# EAGLE design com-uart (EAGLE 6.1)
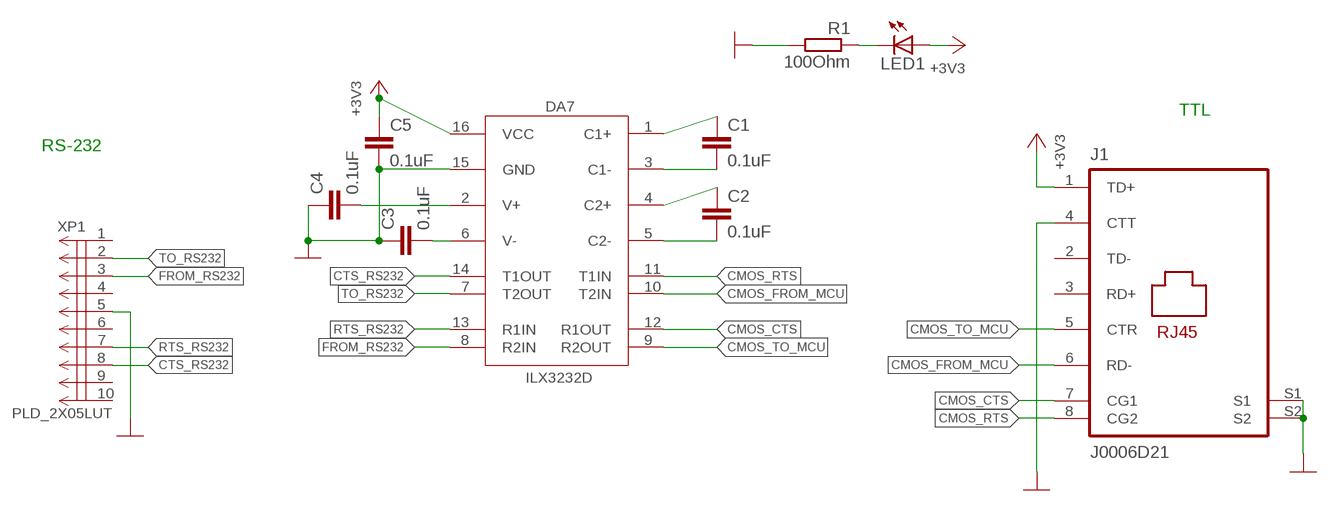
[diagram p0: schematic, sheet 1]

## Parts
C1  0.1uF  CAP0805  [0805]
C2  0.1uF  CAP0805  [0805]
C3  0.1uF  CAP0805  [0805]
C4  0.1uF  CAP0805  [0805]
C5  0.1uF  CAP0805  [0805]
DA7  ILX3232D  [SO16]
J1  J0006D21  [J0-C/D/E]
LED1  LED3MM  [LED3MM]
R1  100Ohm  RESISTOR0805  [0805]
XP1  PLD_2X05LUT  [PLD_2X05_LUT]

## Nets
+3V3: C5.1 DA7.16(VCC) J1.1(TD+) LED1.A
CMOS_CTS: DA7.12(R1OUT) J1.7(CG1)
CMOS_FROM_MCU: DA7.10(T2IN) J1.6(RD-)
CMOS_RTS: DA7.11(T1IN) J1.8(CG2)
CMOS_TO_MCU: DA7.9(R2OUT) J1.5(CTR)
CTS_RS232: DA7.14(T1OUT) XP1.8
FROM_RS232: DA7.8(R2IN) XP1.3
GND: C3.1 C4.1 C5.2 DA7.15(GND) J1.4(CTT) J1.S1 J1.S2 R1.2 XP1.5
N$1: LED1.K(C) R1.1
N$233: C4.2 DA7.2(V+)
N$235: C3.2 DA7.6(V-)
N$238: C1.2 DA7.3(C1-)
N$239: C1.1 DA7.1(C1+)
N$240: C2.1 DA7.4(C2+)
N$241: C2.2 DA7.5(C2-)
RTS_RS232: DA7.13(R1IN) XP1.7
TO_RS232: DA7.7(T2OUT) XP1.2
Unconnected: J1.2(TD-) J1.3(RD+) XP1.1 XP1.4 XP1.6 XP1.9 XP1.10

## Notes on the sheet
- TTL
- RS-232

## Library data of the parts
C1-C5 = barthess:CAP: Capacitor; PARTNO: ?
DA7 = transceiver:ILX3232: RS232 TRANSCEIVER Integral clone; PARTNO: ILX3232D
J1 = connector:J0006D21: RJ45 PulseJack
LED1 = SparkFun:LED: LEDs Standard schematic elements and footprints for 5mm, 3mm, 1206, and 0603 sized LEDs. 5mm - Spark Fun Electronics SKU : COM-00529 (and others)
R1 = barthess:RESISTOR: Resistor
XP1 = connector:PLD_2X05

## Board
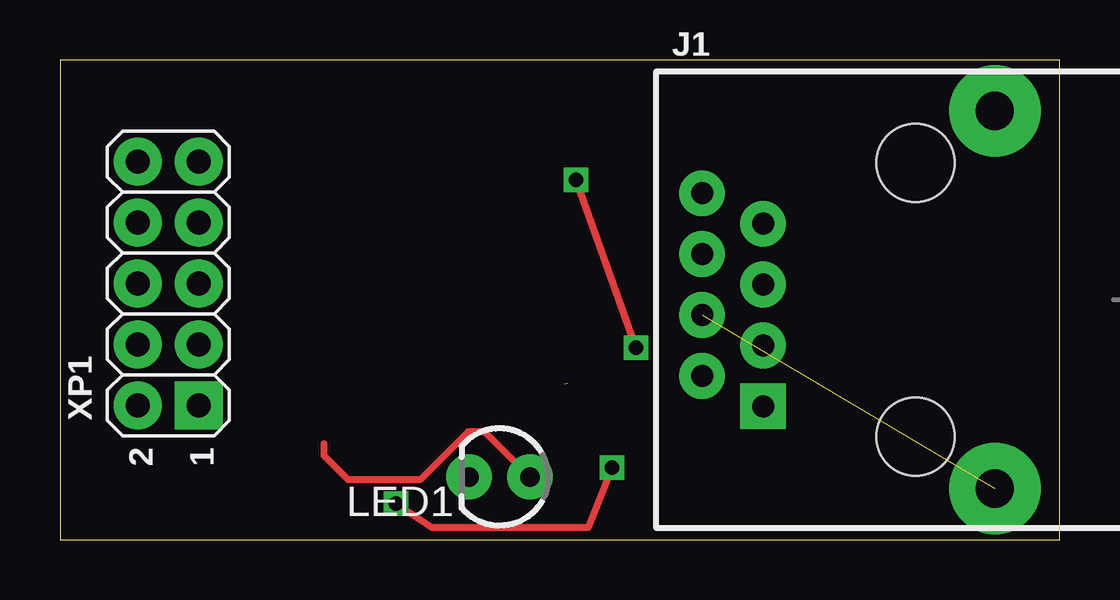
[diagram p1: board, top side]
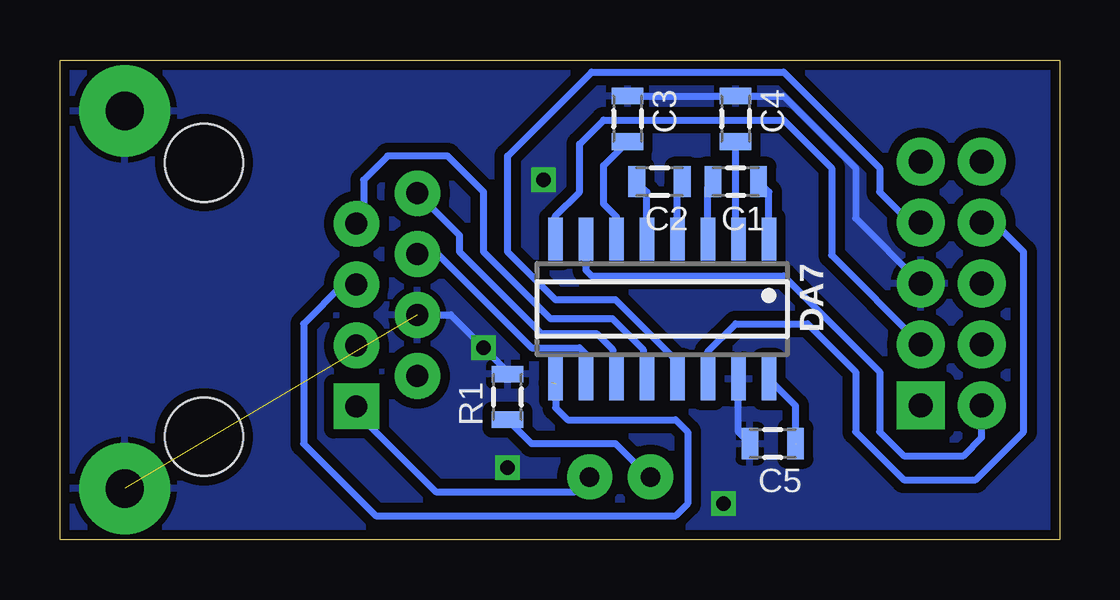
[diagram p2: board, bottom side, seen from below]

Size 41.65 x 20 mm. Coordinates in mm from the lower left corner, seen from the top.
Outline: 0,0 41.65,0 41.65,20 0,20 0,0
Copper layers (1*16): Top 0.035mm / dielectric 1.5mm / Bottom 0.035mm
Design rules: minimum track width 10mil, minimum drill 24mil, track to track 8mil, track to pad 8mil, pad to pad 8mil, via to via 8mil, smd to smd 8mil, copper to edge 10mil, drill to drill 8mil, minimum pad ring 10mil, minimum via ring 8mil, stop-mask expansion 4mil, vias tented up to drill 0mil, thermal gap 10mil

### Footprints (pad centres in the part's own frame; a part is rotated, then mirrored left to right if it is on the bottom)
0805 = smd 0.7 x 1.3: 1 -1,0; 2 0.9,0
SO16 = smd 0.6 x 1.8: 1 -4.445,-2.917; 2 -3.175,-2.917; 3 -1.905,-2.917; 4 -0.635,-2.917; 5 0.635,-2.917; 6 1.905,-2.917; 7 3.175,-2.917; 8 4.445,-2.917; 9 4.445,2.917; 10 3.175,2.917; 11 1.905,2.917; 12 0.635,2.917; 13 -0.635,2.917; 14 -1.905,2.917; 15 -3.175,2.917; 16 -4.445,2.917
J0-C/D/E = drill 0.914 pad 1.9 square: 1 4.445,-6.35 | drill 0.914 pad 1.9: 2 3.175,-8.89; 3 1.905,-6.35; 4 0.635,-8.89; 5 -0.635,-6.35; 6 -1.905,-8.89; 7 -3.175,-6.35; 8 -4.445,-8.89 | drill 1.6 pad 3.81: S1 -7.874,3.302; S2 7.874,3.302 | hole 3.251: -5.715,0; 5.715,0
LED3MM = drill 0.813 pad 1.88: A -1.27,0; K 1.27,0
PLD_2X05_LUT = drill 1 pad 2 square: 1 0,0 | drill 1 pad 2: 2 0,2.54; 3 2.54,0; 4 2.54,2.54; 5 5.08,0; 6 5.08,2.54; 7 7.62,0; 8 7.62,2.54; 9 10.16,0; 10 10.16,2.54

### Placement (x,y rotation side)
C1  13.54,14.92 180 bottom
C2  16.72,14.92 180 bottom
C3  18,17.5 270 bottom
C4  13.5,17.5 270 bottom
C5  12,4 180 bottom
DA7  16.56,9.61 180 bottom
J1  35.65,10 270 top
LED1  18.31,2.61 180 top
R1  23,6 90 bottom
XP1  5.78,5.6 90 top

### Tracks (layer width: path | path; a pad name or v marks a point on that pad's centre or on a via)
+3V3  (1 unrouted)
  Top 0.3: LED1.A 17.69,4.5 17,4.5 15,2.5 12,2.5 11,3.5 C5.1
  Bottom 0.3: 12.21,6.6 DA7.16 11,5.58 C5.1 | J1.1 29.3,5.3 26,2 20.19,2 LED1.A
CMOS_CTS
  Bottom 0.3: DA7.12 17.35,6.85 17.35,7.94 18.62,9.21 21.21,9.21 24,12 24,14.5 25.5,16 28,16 29,15 29,13.47 J1.7
CMOS_FROM_MCU
  Bottom 0.3: 19.89,6.85 DA7.10 19.73,7.73 20,8 22,8 25.91,11.9 J1.6
CMOS_RTS
  Bottom 0.3: DA7.11 18.62,6.85 18.62,7.94 19.26,8.57 21.57,8.57 25,12 25,12.69 J1.8
CMOS_TO_MCU  (1 unrouted)
  Bottom 0.3: 21.16,6.53 DA7.9 | J1.5 29.86,10.63 31.5,9 31.5,4 28.5,1 16,1 15.5,1.5 15.5,4.5 16,5 20.5,5 21,5.5 21,6.5
CTS_RS232
  Bottom 0.3: DA7.14 14.65,7.85 13.5,9 10.5,9 8.5,7 8.5,4.5 6.5,2.5 3.5,2.5 1.5,4.5 1.5,12 3,13.5 3.24,13.26 XP1.8
FROM_RS232
  Bottom 0.3: DA7.8 21,13.5 20,14.5 20,16.5 19,17.5 11.5,17.5 9.5,15.5 9.5,11.86 XP1.3
GND  (via drill 0.6)  (1 unrouted)
  Top 0.3: v24,8 v21.5,15 | v23,3 22,0.5 15.5,0.5 v14,1.5
  Bottom 0.3: C3.1 C4.1 11.5,18.5 8.5,15.5 8.5,13.4 XP1.5 | J1.4 25.36,9.37 v24,8 23,7 | C5.2 13.38,4.48 DA7.15
  pour Bottom (isolate 0.4): 0,0 41.59,0 41.59,20 0,20
N$1
  Bottom 0.3: LED1.K 17.11,2.61 18.5,4 22,4 R1.1
N$233
  Bottom 0.3: DA7.2 13.5,12.64 C4.2
N$235
  Bottom 0.3: DA7.6 18.46,13.46 19,14 19,15.6 C3.2
N$238
  Bottom 0.3: DA7.3 14.65,14.71 C1.2
N$239
  Bottom 0.3: DA7.1 12.11,14.49 C1.1
N$240
  Bottom 0.3: DA7.4 15.92,14.72 C2.1
N$241
  Bottom 0.3: DA7.5 17.19,14.5 C2.2
RTS_RS232
  Bottom 0.3: DA7.13 15.92,7.42 18.5,10 21,10 23,12 23,16 19.5,19.5 11.5,19.5 7.5,15.5 7.5,14.5 6.22,13.22 XP1.7
TO_RS232
  Bottom 0.3: DA7.7 19.73,11.23 19.5,11 11.5,11 7.5,7 7.5,4.5 6.5,3.5 4,3.5 3.24,4.26 XP1.2